# Altium schematic sheet USBCONN_C_24.SchDoc
size A3
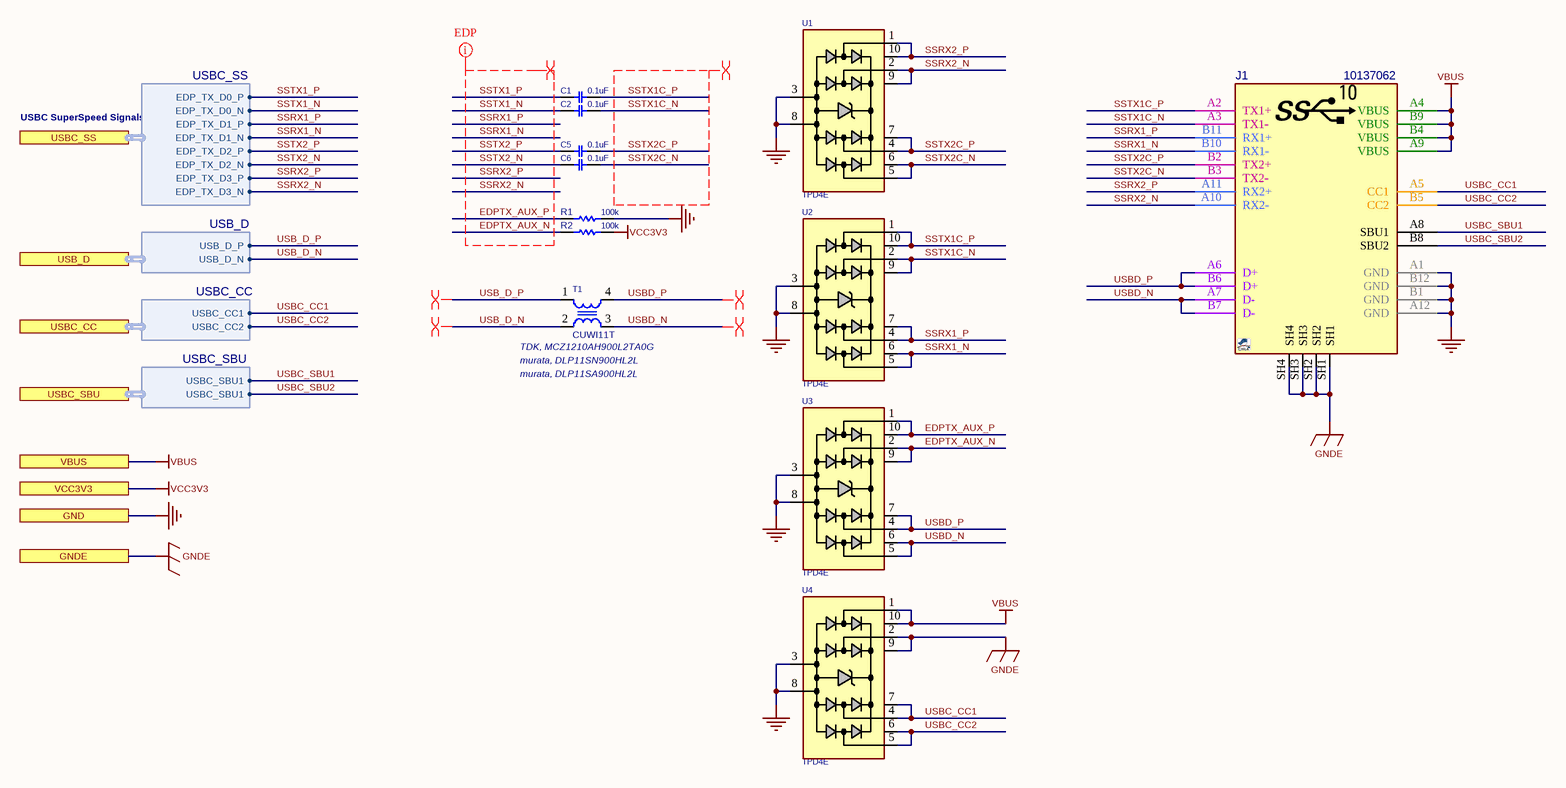
[diagram p0: USBCONN_C_24.SchDoc]

## Parts
C1  0.1uF  [C0402O2]
C2  0.1uF  [C0402O2]
C5  0.1uF  [C0402O2]
C6  0.1uF  [C0402O2]
J1  10137062  [USBC_HYB_10137062]
R1  100k  [R0402]
R2  100k  [R0402]
T1  CUWI11T  [CUWI11T]
U1  TPD4E  [SON50_10_2510]
U2  TPD4E  [SON50_10_2510]
U3  TPD4E  [SON50_10_2510]
U4  TPD4E  [SON50_10_2510]

## Ports
GND, GNDE, USB_D (harness USB_D), USBC_CC (harness USBC_CC), USBC_SBU (harness USBC_SBU), USBC_SS (harness USBC_SS), VBUS, VCC3V3

## Harnesses
USBC_SS: EDP_TX_D0_P, EDP_TX_D0_N, EDP_TX_D1_P, EDP_TX_D1_N, EDP_TX_D2_P, EDP_TX_D2_N, EDP_TX_D3_P, EDP_TX_D3_N
USB_D: USB_D_P, USB_D_N
USBC_SBU: USBC_SBU1, USBC_SBU1
USBC_CC: USBC_CC1, USBC_CC2

## Nets
GND: J1.A1(GND) J1.A12(GND) J1.B1(GND) J1.B12(GND) R1.1 U1.3 U1.8 U2.3 U2.8 U3.3 U3.8 U4.3 U4.8 ; port GND
GNDE: J1.SH1 J1.SH2 J1.SH3 J1.SH4 U4.2 U4.9 ; port GNDE
VBUS: J1.A4(VBUS) J1.A9(VBUS) J1.B4(VBUS) J1.B9(VBUS) U4.1 U4.10 ; port VBUS
VCC3V3: R2.1 ; port VCC3V3
EDPTX_AUX_N: R2.2 U3.2 U3.9
EDPTX_AUX_P: R1.2 U3.1 U3.10
SSRX1_N: J1.B10(RX1-) U2.5 U2.6 ; port USBC_SS.EDP_TX_D1_N
SSRX1_P: J1.B11(RX1+) U2.4 U2.7 ; port USBC_SS.EDP_TX_D1_P
SSRX2_N: J1.A10(RX2-) U1.2 U1.9 ; port USBC_SS.EDP_TX_D3_N
SSRX2_P: J1.A11(RX2+) U1.1 U1.10 ; port USBC_SS.EDP_TX_D3_P
SSTX1_N: C2.1 ; port USBC_SS.EDP_TX_D0_N
SSTX1_P: C1.1 ; port USBC_SS.EDP_TX_D0_P
SSTX1C_N: C2.2 J1.A3(TX1-) U2.2 U2.9
SSTX1C_P: C1.2 J1.A2(TX1+) U2.1 U2.10
SSTX2_N: C6.1 ; port USBC_SS.EDP_TX_D2_N
SSTX2_P: C5.1 ; port USBC_SS.EDP_TX_D2_P
SSTX2C_N: C6.2 J1.B3(TX2-) U1.5 U1.6
SSTX2C_P: C5.2 J1.B2(TX2+) U1.4 U1.7
USB_D_N: T1.2 ; port USB_D.USB_D_N
USB_D_P: T1.1 ; port USB_D.USB_D_P
USBC_CC1: J1.A5(CC1) U4.4 U4.7 ; port USBC_CC.USBC_CC1
USBC_CC2: J1.B5(CC2) U4.5 U4.6 ; port USBC_CC.USBC_CC2
USBC_SBU1: J1.A8(SBU1) J1.B8(SBU2) ; port USBC_SBU.USBC_SBU1  [also labelled USBC_SBU2]
USBD_N: J1.A7(D-) J1.B7(D-) T1.3 U3.5 U3.6
USBD_P: J1.A6(D+) J1.B6(D+) T1.4 U3.4 U3.7

## Layout directives
differential pair: EDPTX_AUX_N, EDPTX_AUX_P, SSRX1_N, SSRX1_P, SSRX2_N, SSRX2_P, SSTX1_N, SSTX1_P, SSTX1C_N, SSTX1C_P, SSTX2_N, SSTX2_P, SSTX2C_N, SSTX2C_P, USB_D_N, USB_D_P, USBD_N, USBD_P
net class EDP: EDPTX_AUX_N, EDPTX_AUX_P, SSRX1_N, SSRX1_P, SSRX2_N, SSRX2_P, SSTX1_N, SSTX1_P, SSTX2_N, SSTX2_P

## Notes on the sheet
- USBC SuperSpeed Signals
- (near T1) murata, DLP11SA900HL2L
- (near T1) murata, DLP11SN900HL2L
- (near T1) TDK, MCZ1210AH900L2TA0G

## Library data of the parts
C1 C2 C5 C6 = CAP_SMD_MLCC: CAP, MLCC; PARAM: X5R, 10%; MANF_P#: GRM155R61E104; MANF: Murata; PARAM2: 25v; PRICE: 10,000:	$0.006; ASSEMBLY: ASSEMBLY; VALUE: 0.1uF
J1 = CONN_USBC_HYB_10137062: CONN, USB, Type C, USB 3.1 Gen 1, Right-Angle, HYBRID; MANF: Amphenol; MANF_P#: 10137062-00021LF; PARAM: 5A; Price: None; Value: 10137062
R1 R2 = RES_SMD: RESISTOR, SMD; PARAM: 0.063W; DESC: DESCRIPTION; DIST#: MOUSER; PARAM2: 1%; MANF_P#: -; MANF: -; ASSEMBLY: ASSEMBLY; PRICE: 100= 0.3$; VALUE: 100k
T1 = EMI_TRANS_CUWI11T: Choke, Common Mode, FER BEAD 90 OHM@100MHZ 250mA 20%; MANF: Chilisin; MANF_P#: CUWI11T-900Y; PARAM: 90 OHM@100MHZ, 0.4A; PRICE: 0.1$; VALUE: CUWI11T
U1-U4 = TVS_X4_TPD4E05U06: TVS, ESD PROTECT, 4CH,; MANF_P#: TPD4E05U06DQA; MANF: Texas Instruments; PARAM2: 6.5Vbr, 0.4pF, –40°~125°C; PARAM: ±12-kV ContactD, ±15-kVAirD; PRICE: 0.6$; VALUE: TPD4E